# EAGLE design YOTSUBA_+X_EM_ver.3.0 (EAGLE 9.6.2)
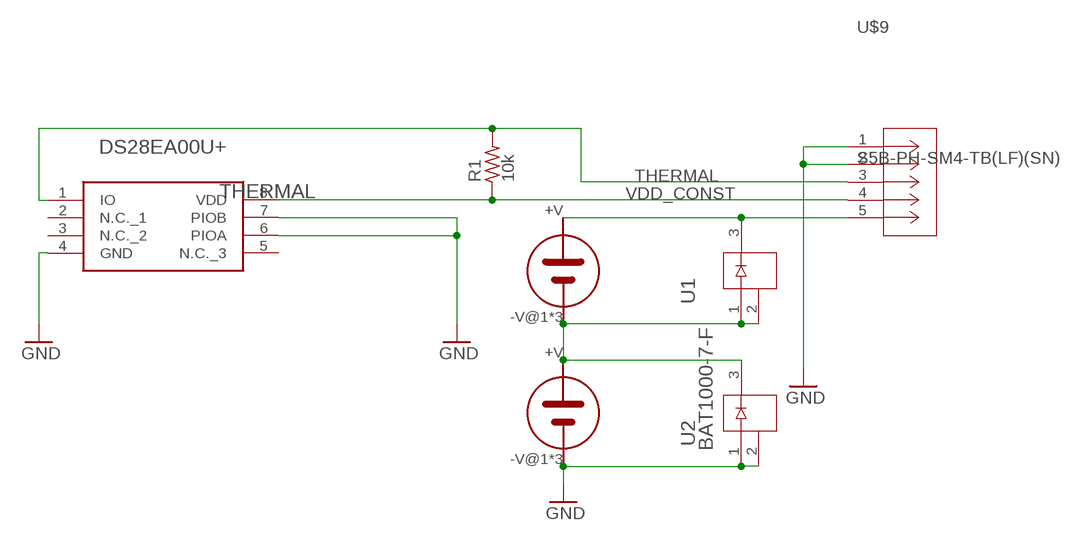
[diagram p0: schematic, sheet 1]

## Parts
R1  10k  R-US_R0805  [R0805]
THERMAL  DS28EA00U+  [SOP65P490X110-8N]
U1  BAT1000-7-F  [SOT23_BAT_DIO]
U2  BAT1000-7-F  [SOT23_BAT_DIO]
U$2  3G30A  [SOLAR_3G30A]
U$3  3G30A  [SOLAR_3G30A]
U$9  S5B-PH-SM4-TB(LF)(SN)  [CONN_S5B-PH-SM4-TB_JST]

## Nets
GND: THERMAL.4(GND) THERMAL.6(PIOA) THERMAL.7(PIOB) U2.1 U2.2 U$3.-V@1(-V) U$3.-V@2(-V) U$3.-V@3(-V) U$9.1 U$9.2
N$5: U1.1 U1.2 U2.3 U$2.-V@1(-V) U$2.-V@2(-V) U$2.-V@3(-V) U$3.+V
N$6: U1.3 U$2.+V U$9.5
THERMAL: R1.2 THERMAL.1(IO) U$9.3
VDD_CONST: R1.1 THERMAL.8(VDD) U$9.4
Unconnected: THERMAL.2(N.C._1) THERMAL.3(N.C._2) THERMAL.5(N.C._3)

## Library data of the parts
R1 = rcl:R-US_: RESISTOR, American symbol; SPICEPREFIX: R
THERMAL = DS28EA00U+:DS28EA00U+: Maxim DS28EA00U+ Temperature Sensor 8-Pin uMAX, -40 +85 C Source: Datasheet <https://datasheets.maximintegrated.com/en/ds/DS28EA00.pdf>; ARROW_PART_NUMBER: DS28EA00U+; ARROW_PRICE-STOCK: https://www.arrow.com/en/products/ds28ea00u/maxim-integrated?region=nac; DESCRIPTION: Maxim DS28EA00U+ Temperature Sensor 8-Pin uMAX, -40 +85 C; HEIGHT: 1.1mm; MANUFACTURER_NAME: Analog Devices; MANUFACTURER_PART_NUMBER: DS28EA00U+; MOUSER_PART_NUMBER: 700-DS28EA00U; MOUSER_PRICE-STOCK: https://www.mouser.co.uk/ProductDetail/Maxim-Integrated/DS28EA00U%2b?qs=7H2Jq%252ByxpJJHHt%2F9DIHuNA%3D%3D
U1 U2 = BAT1000:BAT1000-7-F; COPYRIGHT: Copyright (C) 2023 Ultra Librarian. All rights reserved.; DIGIKEY_PART_NUMBER_1: BAT1000-7FDITR-ND; DIGIKEY_PART_NUMBER_2: BAT1000-7FDICT-ND; DIGIKEY_PART_NUMBER_3: BAT1000-7FDIDKR-ND; MANUFACTURER_PART_NUMBER: BAT1000-7-F; MFR_NAME: Diodes Inc
U$2 U$3 = 3G30A_normal:3G30A
U$9 = S5B-PH-SM4:S5B-PH-SM4-TB(LF)(SN); COPYRIGHT: Copyright (C) 2023 Ultra Librarian. All rights reserved.; DIGIKEY_PART_NUMBER_1: 455-1752-2-ND; DIGIKEY_PART_NUMBER_2: 455-1752-1-ND; DIGIKEY_PART_NUMBER_3: 455-1752-6-ND; MANUFACTURER_PART_NUMBER: S5B-PH-SM4-TB(LF)(SN); MFR_NAME: JST

## Net classes
2 GND: clearance 0.5 mm to class 0, clearance 0.3 mm to class 1, clearance 0.5 mm

## Board
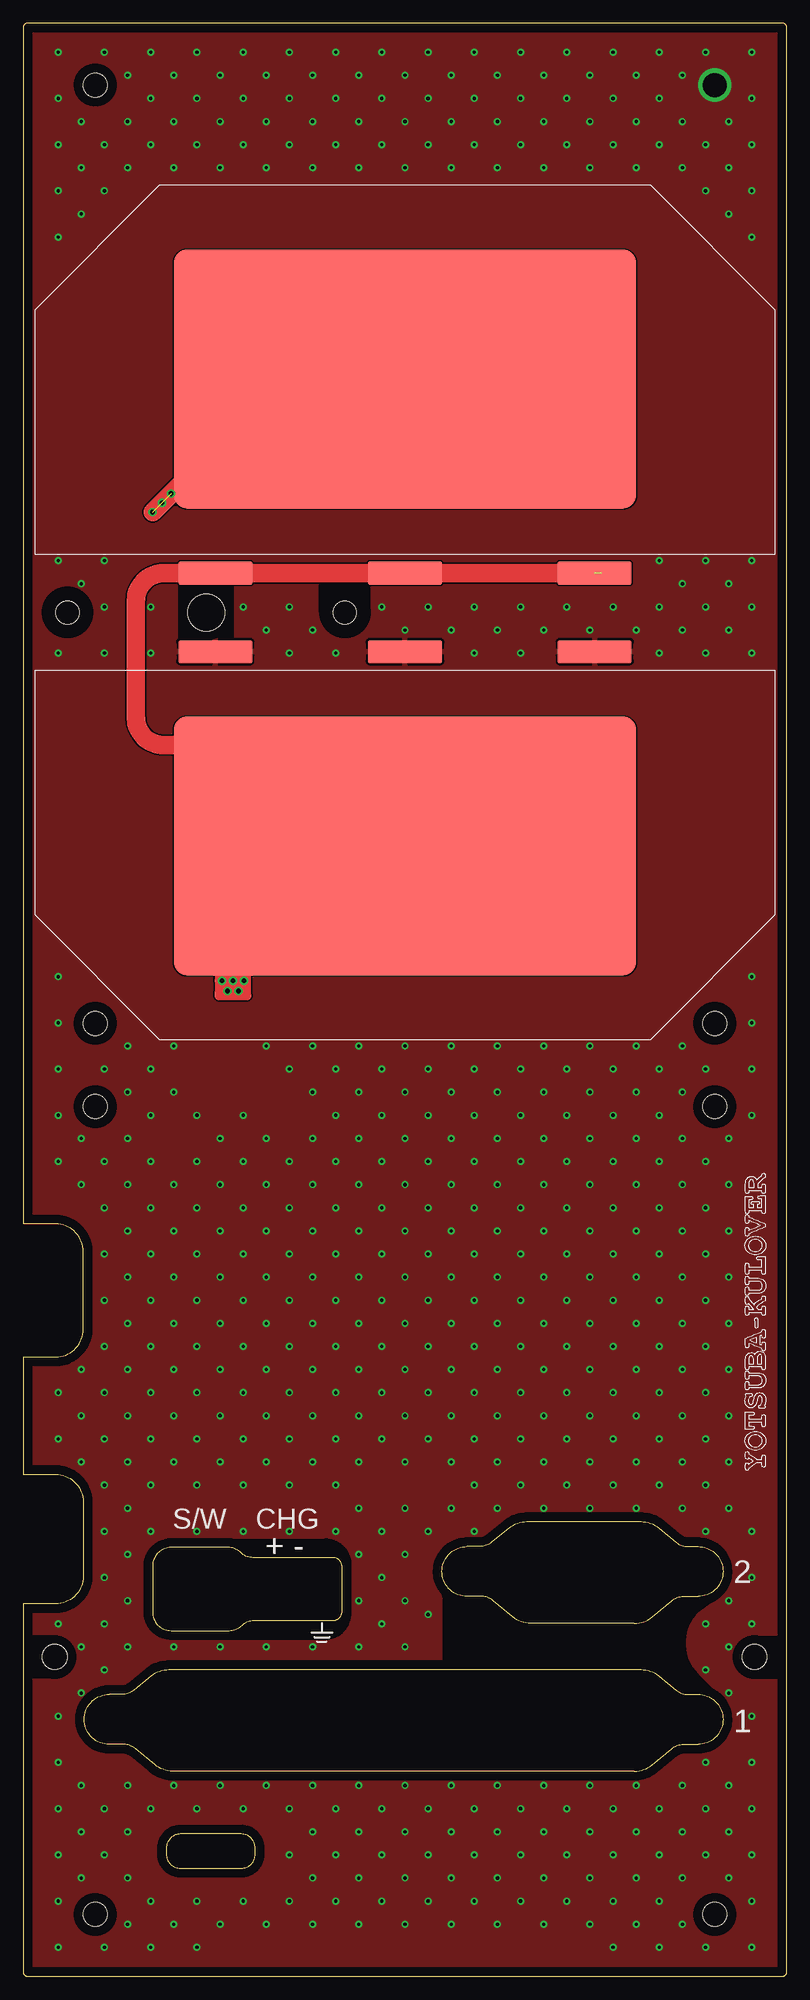
[diagram p1: board, top side]
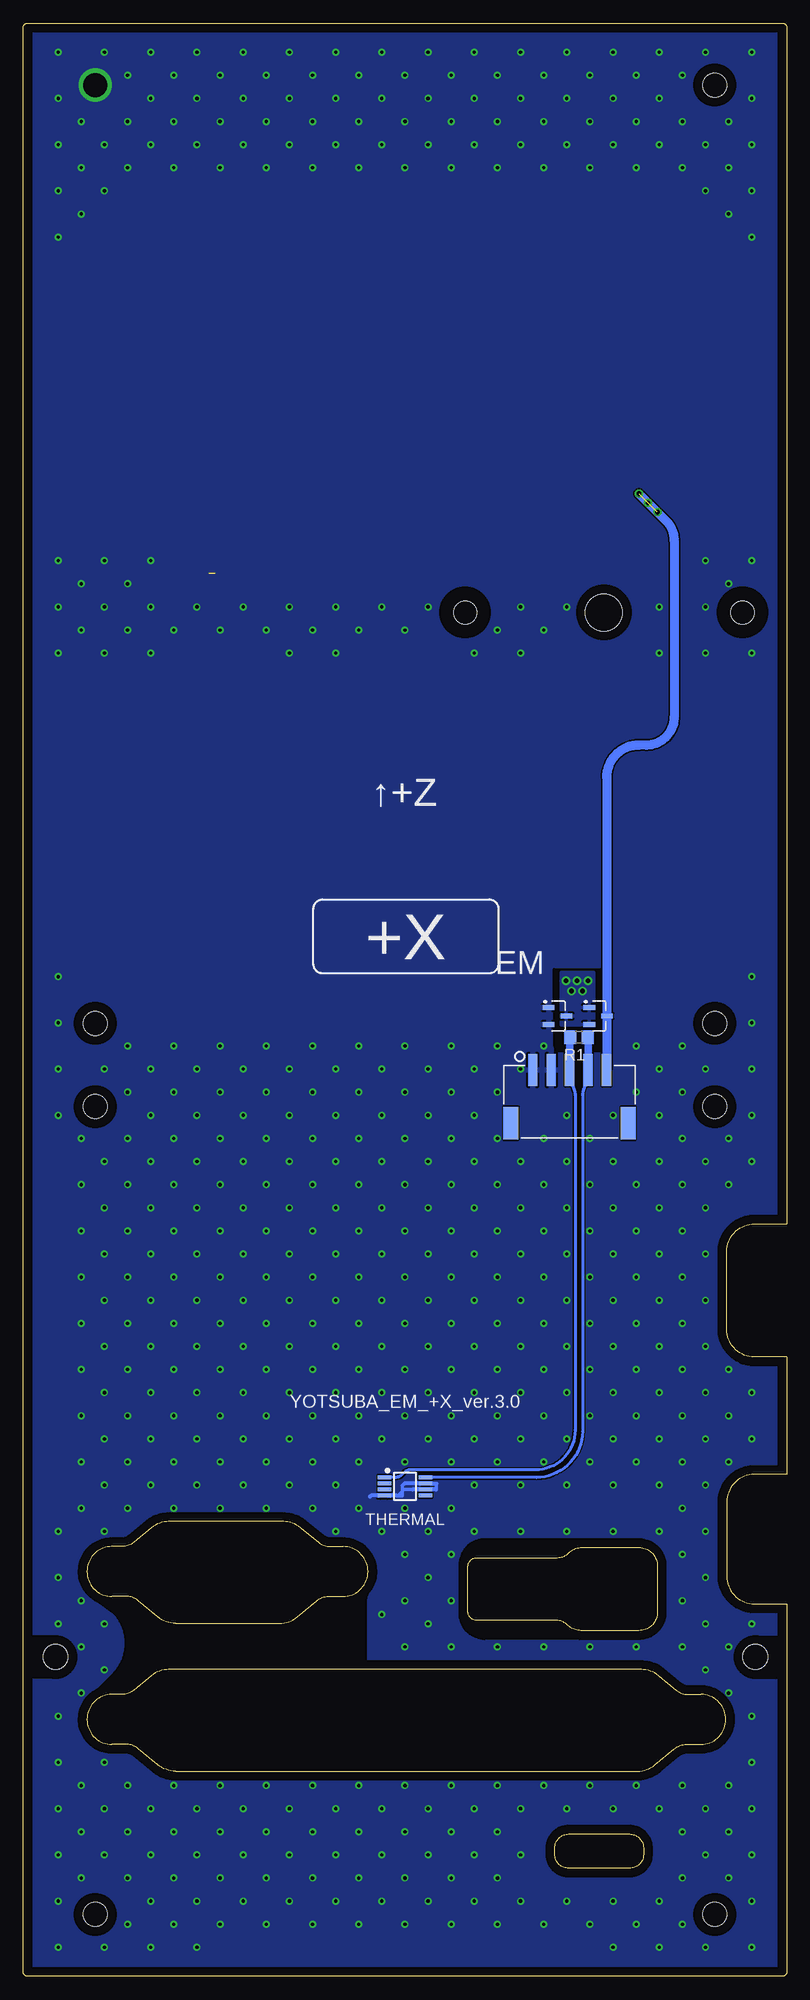
[diagram p2: board, bottom side, seen from below]

Size 82.6 x 211.3 mm. Coordinates in mm from the lower left corner, seen from the top.
Outline: 82.6,0.5 82.6,210.8 arc90 82.1,211.3 0.5,211.3 arc90 0,210.8 0,81.4 3.5,81.4 arc-90 6.5,78.4 6.5,70 arc-90 3.5,67 0,67 0,54.3 3.5,54.3 arc-90 6.5,51.3 6.5,43.3 arc-90 3.5,40.3 0,40.3 0,0.5 arc90 0.5,0 82.1,0 arc90 82.6,0.5
Outline: 66.12,22.2 16.18,22.2 arc-40 14.27,22.89 12.16,24.64 arc40 10.88,25.1 9.3,25.1 arc-90 6.6,27.8 arc-90 9.3,30.5 10.69,30.5 arc39 11.95,30.95 13.87,32.52 arc-39 15.77,33.2 66.83,33.2 arc-39 68.73,32.52 70.65,30.95 arc39 71.91,30.5 73,30.5 arc-90 75.7,27.8 arc-90 73,25.1 71.42,25.1 arc40 70.15,24.64 68.03,22.89 arc-40 66.12,22.2
Outline: 66.12,38.2 54.88,38.2 arc-40 52.97,38.89 50.86,40.64 arc40 49.58,41.1 48,41.1 arc-90 45.3,43.8 arc-90 48,46.5 49.39,46.5 arc39 50.65,46.95 52.57,48.52 arc-39 54.47,49.2 66.83,49.2 arc-39 68.73,48.52 70.65,46.95 arc39 71.91,46.5 73,46.5 arc-90 75.7,43.8 arc-90 73,41.1 71.42,41.1 arc40 70.15,40.64 68.03,38.89 arc-40 66.12,38.2
Outline: 22.17,46.4 16,46.4 arc90 14,44.4 14,39.4 arc90 16,37.4 22.27,37.4 arc45 23.69,37.99 arc-45 24.93,38.5 33.5,38.5 arc90 34.5,39.5 34.5,44.3 arc90 33.5,45.3 24.83,45.3 arc-45 23.59,45.81 arc45 22.17,46.4
Outline: 17,11.7 23.6,11.7 arc90 25.1,13.2 25.1,13.9 arc90 23.6,15.4 17,15.4 arc90 15.5,13.9 15.5,13.2 arc90 17,11.7
Copper layers (1*16): Top 0.035mm / dielectric 1.2mm / Bottom 0.035mm
Design rules "default *": minimum track width 6mil, minimum drill 0.35mm, track to track 6mil, track to pad 6mil, pad to pad 6mil, via to via 6mil, smd to smd 6mil, copper to edge 1mm, drill to drill 6mil, minimum pad ring 10mil, minimum via ring 8mil, stop-mask expansion 4mil, vias tented up to drill 20mil, thermal gap 10mil
Holes 2.6 mm at 7.8,6.7 74.8,6.7 7.8,204.6 74.8,103.1 7.8,94.1 74.8,94.1 7.8,103.1
Holes 4 mm at 19.8,147.55
Holes 2.5 mm at 4.8,147.55 34.8,147.55
Holes 2.7 mm at 79.1,34.55 3.4,34.55
tRestrict: area 2.1,144.9 to 7.5,150.2; area 32.1,144.9 to 37.5,150.2; 18 lines
bRestrict: area 2.1,144.9 to 7.5,150.2; area 32.1,144.9 to 37.5,150.2; 21 lines

### Footprints (pad centres in the part's own frame; a part is rotated, then mirrored left to right if it is on the bottom)
R0805 = smd 1.3 x 1.5: 1 -0.95,0; 2 0.95,0
SOP65P490X110-8N = smd 1.425 x 0.45: 1 -2.212,0.975; 2 -2.212,0.325; 3 -2.212,-0.325; 4 -2.212,-0.975; 5 2.212,-0.975; 6 2.212,-0.325; 7 2.212,0.325; 8 2.212,0.975
SOT23_BAT_DIO = smd 0.568 x 1.259: 1 -0.915,-0.965; 2 0.915,-0.965; 3 0,0.965
SOLAR_3G30A = smd 50 x 28: +V 0,19 | smd 8 x 2.5: -V@1 -20.5,-2; -V@2 20.5,-2; -V@3 0,-2
CONN_S5B-PH-SM4-TB_JST = smd 0.991 x 3.505: 1 4,-3.453; 2 2,-3.453; 3 0,-3.453; 4 -2,-3.453; 5 -4,-3.453 | smd 1.6 x 3.505: 6 -6.35,2.297; 7 6.35,2.297

### Placement (x,y rotation side)
R1  22.5,101.6 180 bottom
THERMAL  41.3,53 0 bottom
U1  20.4,103.9 270 bottom
U2  24.8,103.9 270 bottom
U$2  41.3,153.8 0 top
U$3  41.3,141.3 180 top
U$4  [YOTSUBA_NAME]  78.1,53.5 90 top
U$9  23.5,94.6 180 bottom

### Tracks (layer width: path | path; a pad name or v marks a point on that pad's centre or on a via)
GND  (via drill 0.35, 2.6)
  Bottom 0.4: 42.21,52.02 42.19,52 | 41.38,53.33 41.6,53.1 41.6,52 42.1,52 41.4,52.7 40.5,52.7 40.48,52.67 | 37.9,53.31 37.9,52.7 37.93,52.67
  Bottom 0.45: 41.38,53.33 THERMAL.7 37.89,53.33 37.9,53.31 | 42.1,52 42.19,52 | 40.48,52.67 THERMAL.6 37.93,52.67 | THERMAL.4 44.98,52.02 45.1,51.9
  Bottom 0.454: 42.21,52.02 THERMAL.4
  other vias: 74.8,204.6 23.8,48.15 28.8,48.15 33.8,48.15 41.3,100.65 38.8,98.15 43.8,98.15 46.3,100.65 48.8,98.15 51.3,100.65 38.8,48.15 56.3,100.65 53.8,98.15 51.3,95.65 46.3,95.65 48.8,93.15 43.8,93.15 41.3,95.65 36.3,95.65 36.3,100.65 31.3,100.65 33.8,98.15 13.8,48.15 26.3,100.65 33.8,93.15 31.3,95.65 31.3,90.65 36.3,90.65 38.8,93.15 41.3,90.65 38.8,88.15 33.8,88.15 36.3,85.65 41.3,85.65 43.8,88.15 46.3,90.65 48.8,88.15 51.3,90.65 53.8,93.15 56.3,90.65 53.8,88.15 51.3,85.65 46.3,85.65 48.8,83.15 43.8,83.15 38.8,83.15 33.8,83.15 31.3,85.65 28.8,88.15 28.8,83.15 31.3,80.65 36.3,80.65 41.3,80.65 11.3,70.65 11.3,75.65 13.8,73.15 13.8,68.15 11.3,65.65 48.8,48.15 43.8,48.15 61.3,100.65 66.3,100.65 71.3,100.65 16.3,65.65 21.3,65.65 18.8,68.15 21.3,70.65 16.3,70.65 16.3,75.65 13.8,78.15 11.3,80.65 16.3,80.65 18.8,78.15 18.8,73.15 21.3,75.65 21.3,80.65 18.8,83.15 13.8,83.15 11.3,85.65 11.3,90.65 13.8,88.15 16.3,85.65 21.3,85.65 18.8,88.15 21.3,90.65 18.8,93.15 13.8,93.15 68.8,143.15 73.8,143.15 78.8,143.15 53.8,143.15 48.8,143.15 33.8,143.15 28.8,143.15 13.8,143.15 8.8,143.15 3.8,143.15 8.8,88.15 3.8,88.15 6.3,85.65 31.3,70.65 8.8,83.15 26.3,70.65 28.8,68.15 23.8,68.15 26.3,65.65 23.8,63.15 28.8,63.15 31.3,65.65 33.8,68.15 33.8,63.15 31.3,60.65 26.3,60.65 23.8,58.15 28.8,58.15 33.8,58.15 31.3,55.65 26.3,55.65 13.8,63.15 16.3,60.65 18.8,63.15 18.8,58.15 3.8,103.15 3.8,108.15 11.3,60.65 13.8,58.15 16.3,100.65 11.3,100.65 36.3,20.65 38.8,18.15 48.8,18.15 46.3,20.65 41.3,20.65 51.3,20.65 53.8,18.15 63.8,18.15 61.3,20.65 56.3,20.65 66.3,20.65 68.8,18.15 13.8,148.15 8.8,148.15 8.8,153.15 8.8,73.15 6.3,150.65 3.8,153.15 8.8,78.15 53.8,53.15 58.8,53.15 6.3,65.65 68.8,153.15 71.3,150.65 68.8,148.15 73.8,148.15 73.8,153.15 78.8,148.15 76.3,150.65 78.8,153.15 8.8,63.15 8.8,68.15 46.3,50.65 36.3,65.65 41.3,55.65 46.3,55.65 48.8,53.15 48.8,58.15 43.8,58.15 41.3,60.65 46.3,60.65 43.8,63.15 41.3,65.65 46.3,65.65 48.8,63.15 43.8,68.15 66.3,50.65 68.8,53.15 73.8,53.15 48.8,68.15 71.3,55.65 66.3,55.65 68.8,58.15 73.8,58.15 78.8,188.15 71.3,60.65 66.3,60.65 76.3,190.65 73.8,193.15 71.3,195.65 76.3,195.65 78.8,193.15 78.8,198.15 73.8,198.15 68.8,198.15 76.3,200.65 71.3,200.65 66.3,200.65 63.8,198.15 61.3,200.65 58.8,198.15 56.3,200.65 53.8,198.15 51.3,200.65 48.8,198.15 46.3,200.65 48.8,203.15 53.8,203.15 58.8,203.15 63.8,203.15 68.8,203.15 66.3,205.65 68.8,208.15 63.8,208.15 61.3,205.65 58.8,208.15 56.3,205.65 53.8,208.15 51.3,205.65 48.8,208.15 43.8,198.15 38.8,198.15 41.3,200.65 43.8,203.15 38.8,203.15 41.3,205.65 46.3,205.65 43.8,208.15 38.8,208.15 36.3,205.65 33.8,208.15 33.8,203.15 31.3,205.65 23.8,208.15 28.8,208.15 26.3,205.65 28.8,203.15 23.8,203.15 21.3,205.65 18.8,208.15 18.8,203.15 16.3,205.65 13.8,208.15 13.8,203.15 11.3,205.65 8.8,208.15 3.8,208.15 3.8,203.15 3.8,198.15 6.3,200.65 11.3,200.65 8.8,198.15 6.3,195.65 3.8,193.15 8.8,193.15 11.3,195.65 13.8,198.15 16.3,200.65 21.3,200.65 26.3,200.65 31.3,200.65 36.3,200.65 33.8,198.15 28.8,198.15 23.8,198.15 18.8,198.15 16.3,195.65 6.3,190.65 3.8,188.15 6.3,60.65 33.8,18.15 8.8,58.15 3.8,58.15 6.3,55.65 56.3,65.65 51.3,65.65 58.8,63.15 61.3,65.65 61.3,60.65 58.8,58.15 53.8,58.15 51.3,60.65 53.8,63.15 56.3,60.65 56.3,55.65 51.3,55.65 78.8,203.15 78.8,208.15 73.8,208.15 71.3,205.65 26.3,90.65 23.8,88.15 23.8,83.15 26.3,85.65 23.8,93.15 26.3,80.65 28.8,78.15 23.8,78.15 33.8,78.15 38.8,78.15 43.8,78.15 46.3,80.65 48.8,78.15 51.3,80.65 53.8,83.15 56.3,85.65 58.8,88.15 58.8,93.15 56.3,95.65 58.8,98.15 61.3,95.65 63.8,98.15 68.8,98.15 66.3,95.65 63.8,93.15 61.3,90.65 63.8,88.15 66.3,90.65 68.8,93.15 71.3,90.65 68.8,88.15 66.3,85.65 61.3,85.65 58.8,83.15 63.8,83.15 61.3,80.65 56.3,80.65 53.8,78.15 58.8,78.15 78.8,103.15 78.8,98.15 73.8,98.15 78.8,93.15 73.8,83.15 73.8,88.15 76.3,90.65 71.3,95.65 71.3,85.65 68.8,83.15 71.3,80.65 66.3,80.65 63.8,78.15 68.8,78.15 73.8,78.15 73.8,73.15 71.3,75.65 66.3,75.65 61.3,75.65 56.3,75.65 51.3,75.65 46.3,75.65 48.8,73.15 53.8,73.15 58.8,73.15 63.8,73.15 68.8,73.15 66.3,70.65 71.3,70.65 76.3,70.65 76.3,75.65 76.3,80.65 76.3,60.65 76.3,65.65 71.3,65.65 73.8,68.15 68.8,68.15 63.8,68.15 61.3,70.65 56.3,70.65 58.8,68.15 53.8,68.15 51.3,70.65 46.3,70.65 43.8,73.15 41.3,75.65 36.3,75.65 31.3,75.65 26.3,75.65 23.8,73.15 28.8,73.15 33.8,73.15 38.8,73.15 36.3,70.65 41.3,70.65 38.8,68.15 63.8,63.15 66.3,65.65 68.8,63.15 73.8,63.15 58.8,18.15 43.8,18.15 41.3,15.65 36.3,15.65 38.8,13.15 43.8,13.15 46.3,15.65 51.3,15.65 48.8,13.15 46.3,10.65 41.3,10.65 43.8,8.15 36.3,60.65 38.8,63.15 38.8,58.15 36.3,55.65 16.3,55.65 11.3,55.65 8.8,53.15 8.8,48.15 11.3,50.65 13.8,53.15 18.8,53.15 36.3,45.65 41.3,45.65 38.8,43.15 36.3,40.65 41.3,40.65 38.8,38.15 41.3,35.65 43.8,39.15 51.3,50.65 61.3,55.65 63.8,53.15 61.3,50.65 56.3,50.65 11.3,45.65 8.8,43.15 11.3,40.65 8.8,38.15 11.3,35.65 8.8,33.15 6.3,35.65 3.8,38.15 16.3,35.65 21.3,35.65 26.3,35.65 31.3,35.65 36.3,35.65 53.8,13.15 56.3,15.65 61.3,15.65 66.3,15.65 63.8,13.15 58.8,13.15 63.8,58.15 71.3,50.65 76.3,50.65 76.3,55.65 78.8,48.15 78.8,43.15 73.8,48.15 71.3,20.65 76.3,20.65 73.8,23.15 78.8,23.15 78.8,28.15 76.3,30.65 73.8,33.15 76.3,35.65 78.8,38.15 78.8,18.15 73.8,18.15 76.3,15.65 71.3,15.65 73.8,13.15 78.8,13.15 71.3,10.65 68.8,13.15 21.3,60.65 21.3,55.65 28.8,53.15 33.8,53.15 31.3,15.65 31.3,20.65 26.3,20.65 21.3,20.65 16.3,20.65 11.3,20.65 6.3,20.65 3.8,23.15 3.8,28.15 6.3,30.65 3.8,18.15 3.8,13.15 3.8,8.15 3.8,3.15 8.8,3.15 13.8,3.15 18.8,3.15 31.3,5.65 26.3,5.65 46.3,5.65 28.8,8.15 31.3,10.65 33.8,13.15 36.3,10.65 33.8,8.15 36.3,5.65 23.8,8.15 21.3,5.65 16.3,5.65 18.8,8.15 13.8,8.15 11.3,5.65 11.3,10.65 8.8,18.15 13.8,18.15 18.8,18.15 23.8,18.15 8.8,13.15 6.3,15.65 6.3,10.65 28.8,18.15 28.8,13.15 38.8,8.15 41.3,5.65 48.8,8.15 51.3,10.65 56.3,10.65 53.8,8.15 51.3,5.65 61.3,10.65 66.3,10.65 68.8,8.15 63.8,8.15 58.8,8.15 56.3,5.65 61.3,5.65 66.3,5.65 63.8,3.15 68.8,3.15 71.3,5.65 73.8,3.15 76.3,10.65 78.8,8.15 78.8,3.15 3.8,63.15 3.8,93.15 3.8,98.15 8.8,98.15 13.8,98.15 11.3,95.65 6.3,90.65 16.3,95.65 28.8,98.15 78.8,108.15 71.3,145.65 76.3,145.65 63.8,148.15 66.3,145.65 61.3,145.65 58.8,148.15 53.8,148.15 56.3,145.65 51.3,145.65 48.8,148.15 46.3,145.65 43.8,148.15 41.3,145.65 38.8,148.15 31.3,145.65 28.8,148.15 26.3,145.65 23.8,148.15 21.3,195.65 26.3,195.65 31.3,195.65 36.3,195.65 41.3,195.65 46.3,195.65 51.3,195.65 56.3,195.65 61.3,195.65 66.3,195.65 18.8,48.15 11.3,15.65 23.8,53.15 36.3,50.65 41.3,50.65 76.3,85.65 73.8,38.15 76.3,40.65
  pour Bottom: -8.2,-17.1 -8.2,220.3 97.7,220.3 97.7,-17.1
  pour Top: -15.6,-10.6 -15.6,218.1 90.9,218.1 90.9,-10.6
N$5  (via drill 0.5)  (1 unrouted)
  Top 1: U$3.+V 21.5,122.3 v21.5,107.7 21.5,106.7 21.2,106.4 | 21.2,107.7 21.2,108.5 24.2,108.5 24.2,106.1 21.2,106.1 21.2,106.4 | 21.2,107.7 21.2,106.4 | 21.9,106.7 23.2,106.7 v23.3,106.6 23.3,107.7 21.2,107.7
  Top 2: 62.5,151.8 U$2.-V@3 U$2.-V@1 15.2,151.8 arc90 12.2,148.8 12.2,136.2 arc90 15.2,133.2 41.4,133.2 41.4,127.1 | 41.4,127.1 41.4,124.8 | 41.4,127.1 41.3,127.1 U$3.+V
  other vias: 22.7,107.7 23.9,107.7 22.1,106.6
  pour Bottom: 20.9,108.6 24.4,108.6 24.4,102.9 20.9,102.9
N$6  (via drill 0.5)  (2 unrouted)
  Top 2: U$2.+V 34.7,172.8 31.9,170 25.6,170 v14,158.4
  Bottom 1: v16,160.4 13.08,157.48 arc45 12.2,155.36 12.2,136.2 arc90 15.2,133.2 16,133.2 arc-90 19.5,129.7 19.5,104 U1.3 19.5,103.83 U$9.5
  other vias: 15,159.4
THERMAL
  Bottom 0.3: U$9.3 23.5,96.75 arc45 22.9,95.3 22.9,59.1 arc90 27.2,54.8 40.69,54.8 arc-45 41.39,54.51 41.63,54.27 arc45 42.34,53.98 THERMAL.1
  Bottom 0.8: U$9.3 23.5,101.6 R1.2
VDD_CONST
  Bottom 0.3: U$9.4 21.5,96.75 arc-45 22.1,95.3 22.1,58.98 arc90 27.1,53.98 THERMAL.8
  Bottom 0.8: U$9.4 21.5,101.6 R1.1

### Text on the board
tPlace: S/W | CHG | + | - | 2 | 1
bNames: ↑+Z | +X | EM | YOTSUBA_EM_+X_ver.3.0